# Altium schematic sheet fpga_power.SchDoc
size A3
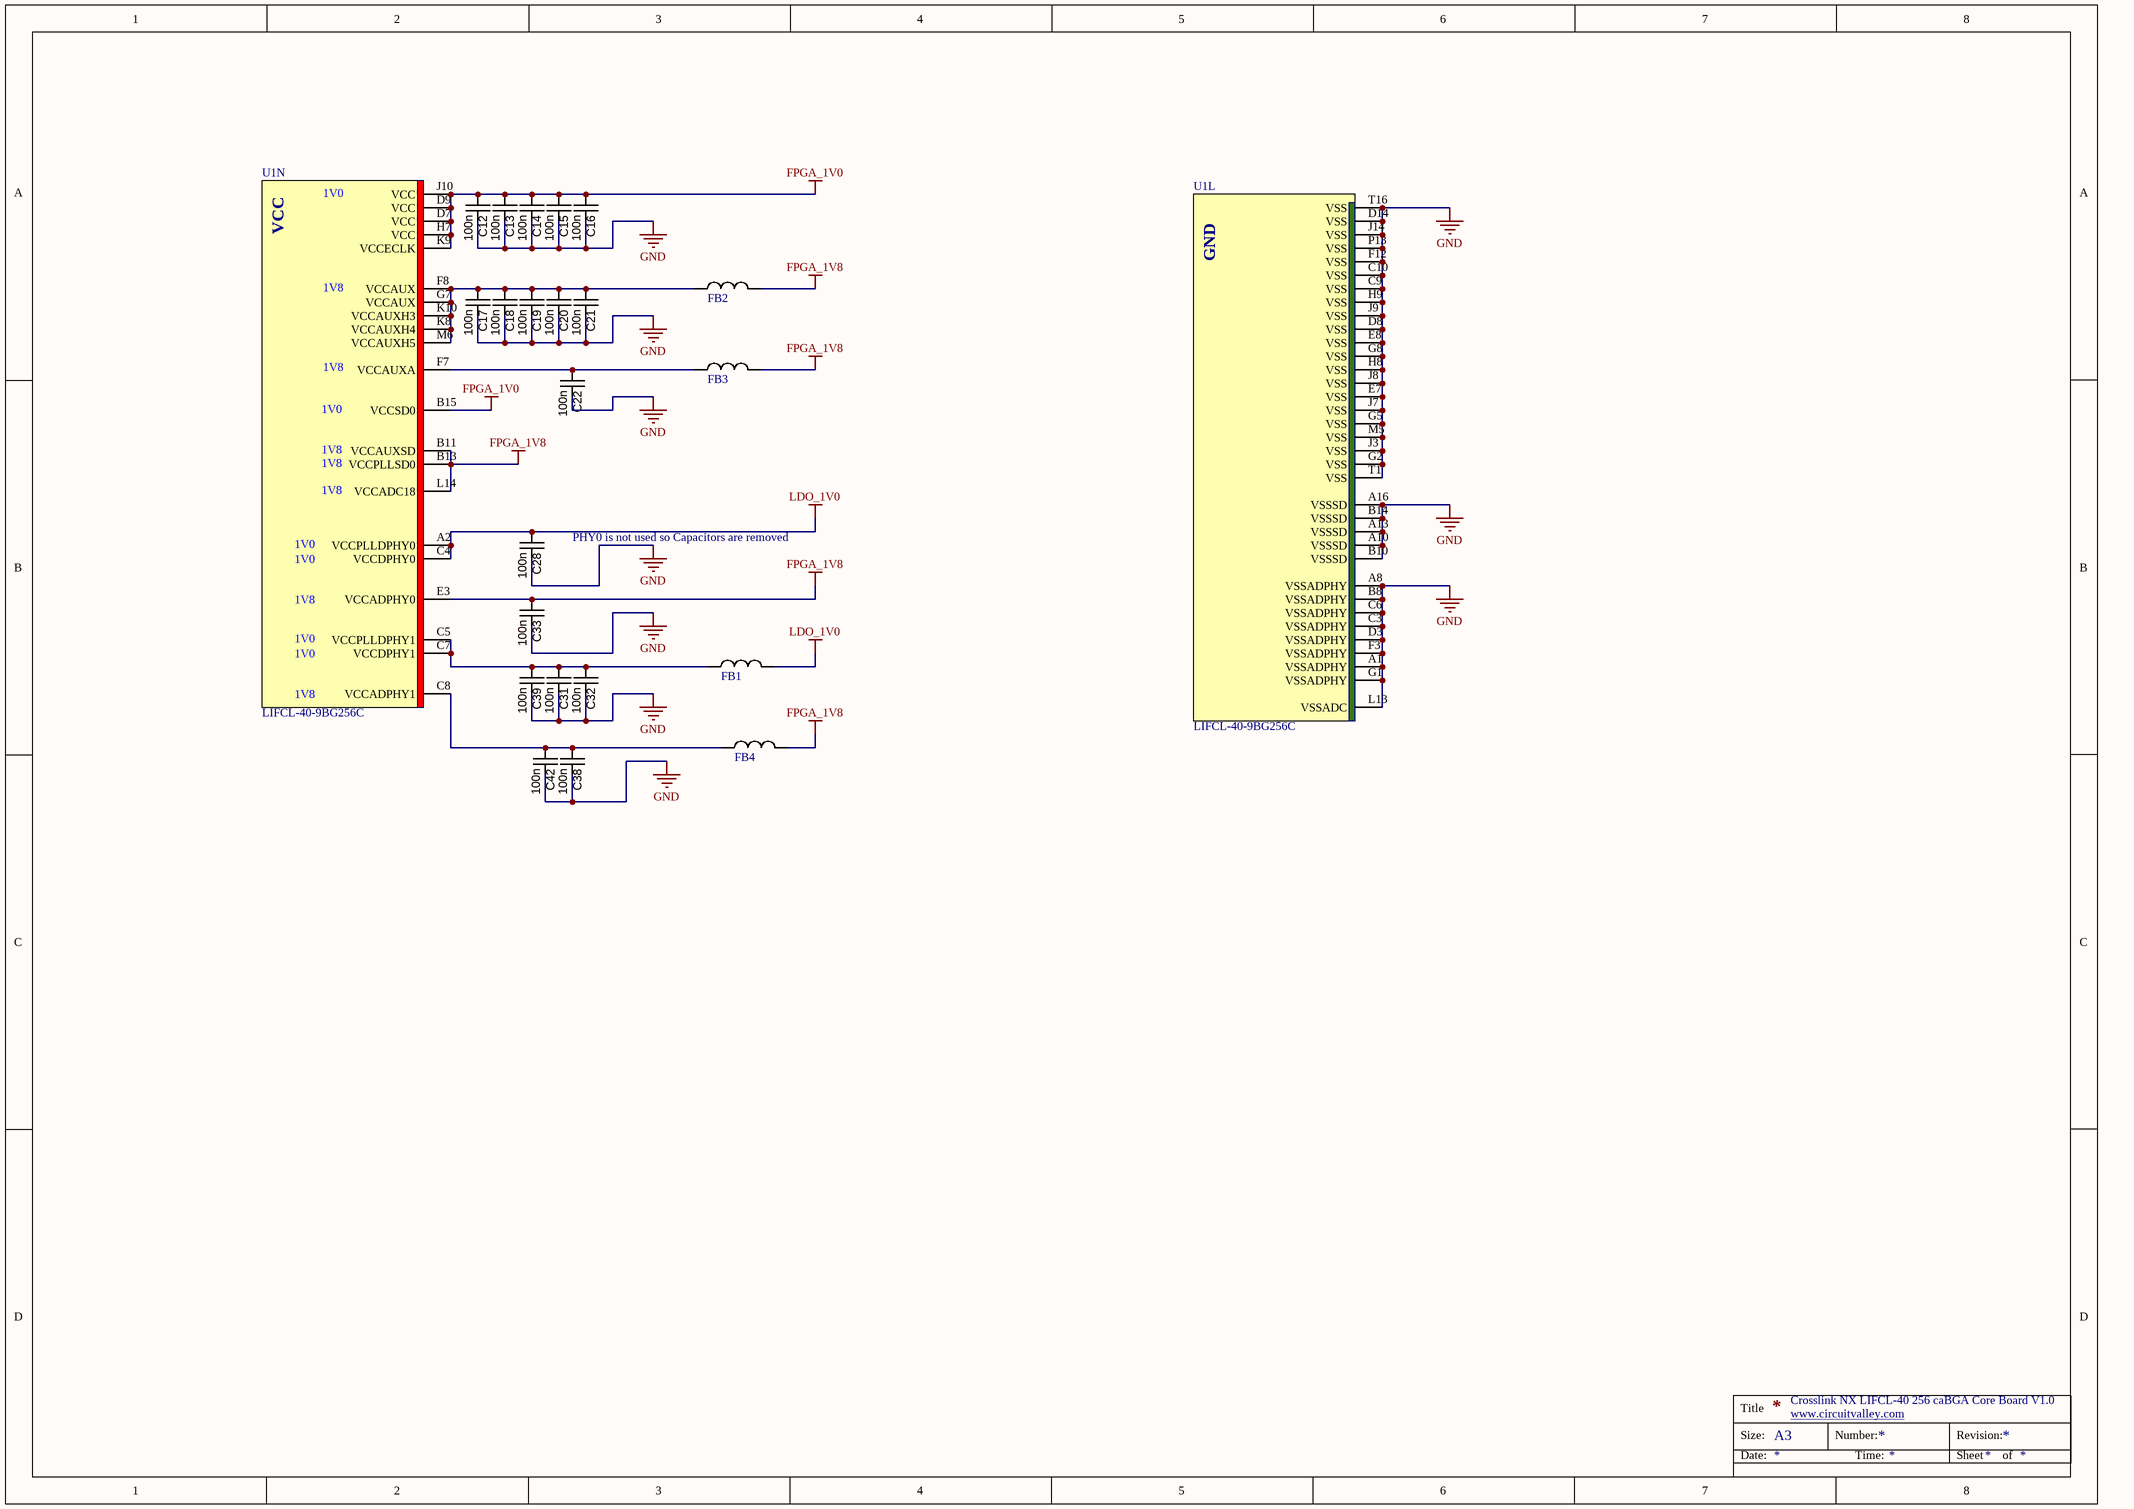
[diagram p0: fpga_power.SchDoc]

## Parts
C12  100n  [CAPC1005N]
C13  100n  [CAPC1005N]
C14  100n  [CAPC1005N]
C15  100n  [CAPC1005N]
C16  100n  [CAPC1005N]
C17  100n  [CAPC1005N]
C18  100n  [CAPC1005N]
C19  100n  [CAPC1005N]
C20  100n  [CAPC1005N]
C21  100n  [CAPC1005N]
C22  100n  [CAPC1005N]
C28  100n  [CAPC1005N]
C31  100n  [CAPC1005N]
C32  100n  [CAPC1005N]
C33  100n  [CAPC1005N]
C38  100n  [CAPC1005N]
C39  100n  [CAPC1005N]
C42  100n  [CAPC1005N]
FB1  Ferrite  [INDC1608N]  (value not drawn)
FB2  Ferrite  [INDC1608N]  (value not drawn)
FB3  Ferrite  [INDC1608N]  (value not drawn)
FB4  Ferrite  [INDC1608N]  (value not drawn)
U1  LIFCL-40-9BG256C  [Lattice_256_CABGA]  (parts L,N of 14)

## Nets
FPGA_1V0: C12.2 C13.2 C14.2 C15.2 C16.2 U1.B15(VCCSD0) U1.D7(VCC) U1.D9(VCC) U1.H7(VCC) U1.J10(VCC) U1.K9(VCCECLK)
FPGA_1V8: C33.2 FB2.2 FB3.2 FB4.2 U1.B11(VCCAUXSD) U1.B13(VCCPLLSD0) U1.E3(VCCADPHY0) U1.L14(VCCADC18)
GND: C12.1 C13.1 C14.1 C15.1 C16.1 C17.1 C18.1 C19.1 C20.1 C21.1 C22.1 C28.1 C31.1 C32.1 C33.1 C38.1 C39.1 C42.1 U1.A1(VSSADPHY) U1.A8(VSSADPHY) U1.A10(VSSSD) U1.A13(VSSSD) U1.A16(VSSSD) U1.B8(VSSADPHY) U1.B10(VSSSD) U1.B14(VSSSD) U1.C3(VSSADPHY) U1.C6(VSSADPHY) U1.C9(VSS) U1.C10(VSS) U1.D3(VSSADPHY) U1.D8(VSS) U1.D14(VSS) U1.E7(VSS) U1.E8(VSS) U1.F3(VSSADPHY) U1.F12(VSS) U1.G1(VSSADPHY) U1.G2(VSS) U1.G5(VSS) U1.G8(VSS) U1.H8(VSS) U1.H9(VSS) U1.J3(VSS) U1.J7(VSS) U1.J8(VSS) U1.J9(VSS) U1.J14(VSS) U1.L13(VSSADC) U1.M5(VSS) U1.P13(VSS) U1.T1(VSS) U1.T16(VSS)
LDO_1V0: C28.2 FB1.2 U1.A2(VCCPLLDPHY0) U1.C4(VCCDPHY0)
NetC17_2: C17.2 C18.2 C19.2 C20.2 C21.2 FB2.1 U1.F8(VCCAUX) U1.G7(VCCAUX) U1.K8(VCCAUXH4) U1.K10(VCCAUXH3) U1.M6(VCCAUXH5)
NetC22_2: C22.2 FB3.1 U1.F7(VCCAUXA)
NetC31_2: C31.2 C32.2 C39.2 FB1.1 U1.C5(VCCPLLDPHY1) U1.C7(VCCDPHY1)
NetC38_2: C38.2 C42.2 FB4.1 U1.C8(VCCADPHY1)

## Notes on the sheet
- (near C28) PHY0 is not used so Capacitors are removed
- Crosslink NX LIFCL-40 256 caBGA Core Board V1.0
- www.circuitvalley.com <http://www.circuitvalley.com>
- Title
- Size:
- Date:
- A3
- Number:
- Time:
- Revision:
- Sheet
- of
- (in symbol LIFCL-40-9BG256C, part L) GND
- (in symbol LIFCL-40-9BG256C, part N) 1V0; 1V8

## Library data of the parts
C12-C22 C28 C31-C33 C38 C39 C42 = CAPC_10n_0402_16V_10%: Capacitor SMD Cer 10nF 10% 16V X7R 0402; Manufacturer 1: AVX Corporation; Manufacturer Part Number 1: 0402YC103KAT2A; Ratings: 16V; X7R; Tolerance: ±10%; Operating Temperature: -55°C ~ 125°C; Package / Case: 0402 (1005 Metric); Size / Dimension: 0.039" L x 0.020" W (1.00mm x 0.50mm); Manufacturer 2: Yageo; Manufacturer Part Number 2: CC0402KRX7R7BB103; Supplier 1: Digi-Key; Supplier Part Number 1: 478-1114-1-ND; ComponentLink1URL: http://www.avx.com/docs/Catalogs/cx7r.pdf; ComponentLink1Description: http://www.avx.com/docs/Catalogs/cx7r.pdf; Supplier 2: Digi-Key; Supplier Part Number 2: 311-1042-1-ND; ComponentLink2URL: http://www.yageo.com/documents/recent/UPY-GPHC_X7R_6.3V-to-50V_8.pdf; ComponentLink2Description: http://www.yageo.com/documents/recent/UPY-GPHC_X7R_6.3V-to-50V_8.pdf; Value: 100n
U1 = LIFCL-40-9BG256C: FPGA CorsslinkNX  LIFCL-40-9BG256C